# Altium schematic sheet Master.SchDoc: Master
size A4; CheckedBy: DMH; Organization: Detex Corp; Address1: Detex Corp; Address2: 302 Detex Dr; Address3: New Braunfels, TX 78130; Address4: (830) 629-290; DocumentNumber: 107027; Revision: A1; SheetNumber: 1; SheetTotal: 5; ProjectName: EE Project - 1.17.2021.PrjPcb
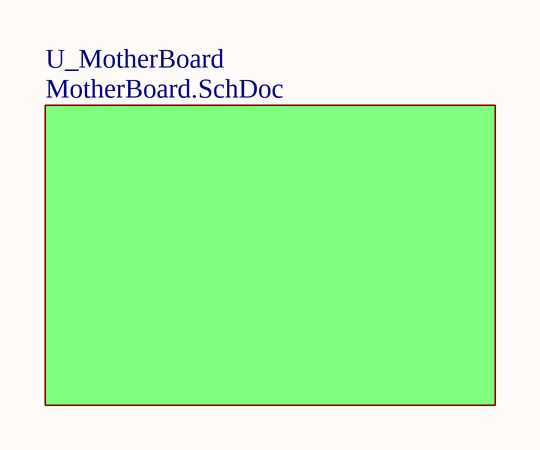
[diagram p0: Master.SchDoc]

## Sub-sheets
U_MotherBoard = MotherBoard.SchDoc: no entries

## Notes on the sheet
- Title
- Size:
- Date:
- A4
- Number:
- Time:
- Revision:
- Sheet
- of
- Detex Corporation
- 302 Detex Drive
- New Braunfels, TX
- 78130
- (830) 629-2900
- File: